# EAGLE board Schematic_BG96_Mega2560 (EAGLE 9.5.2)
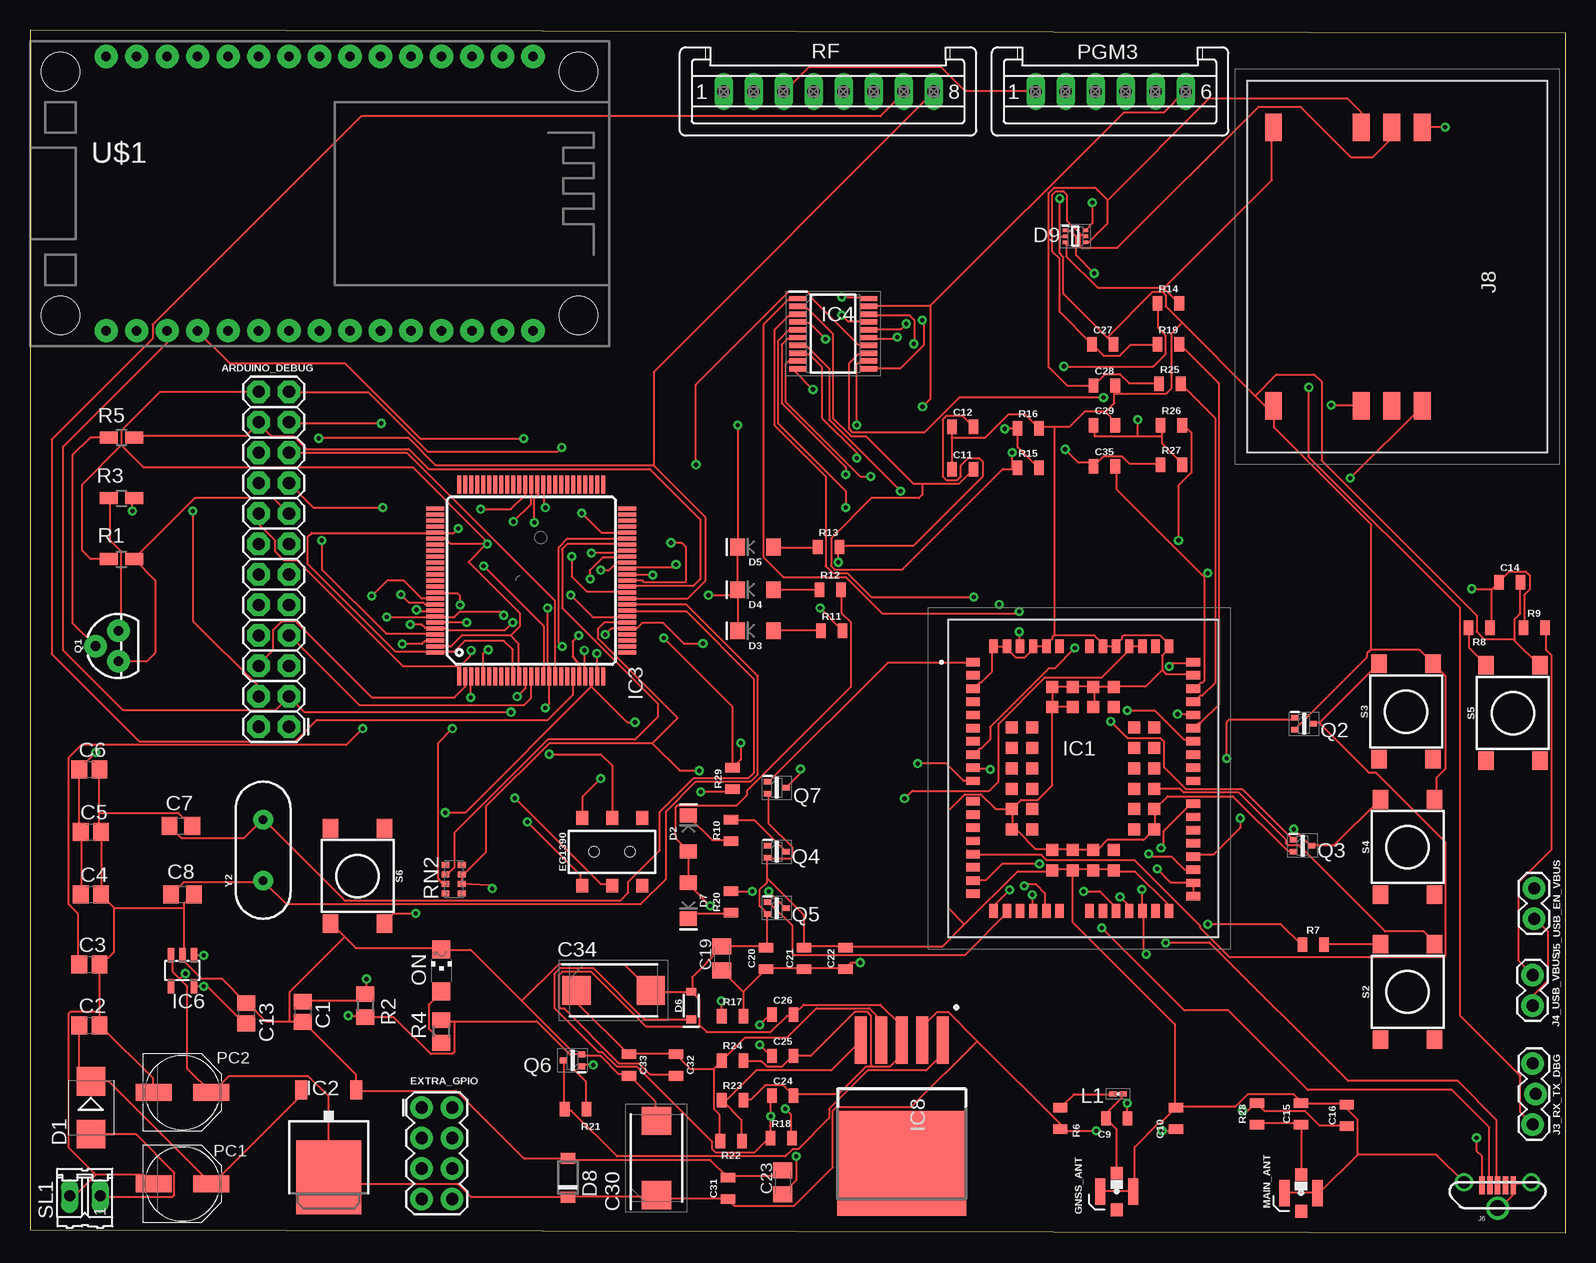
[diagram p2: board, top side]
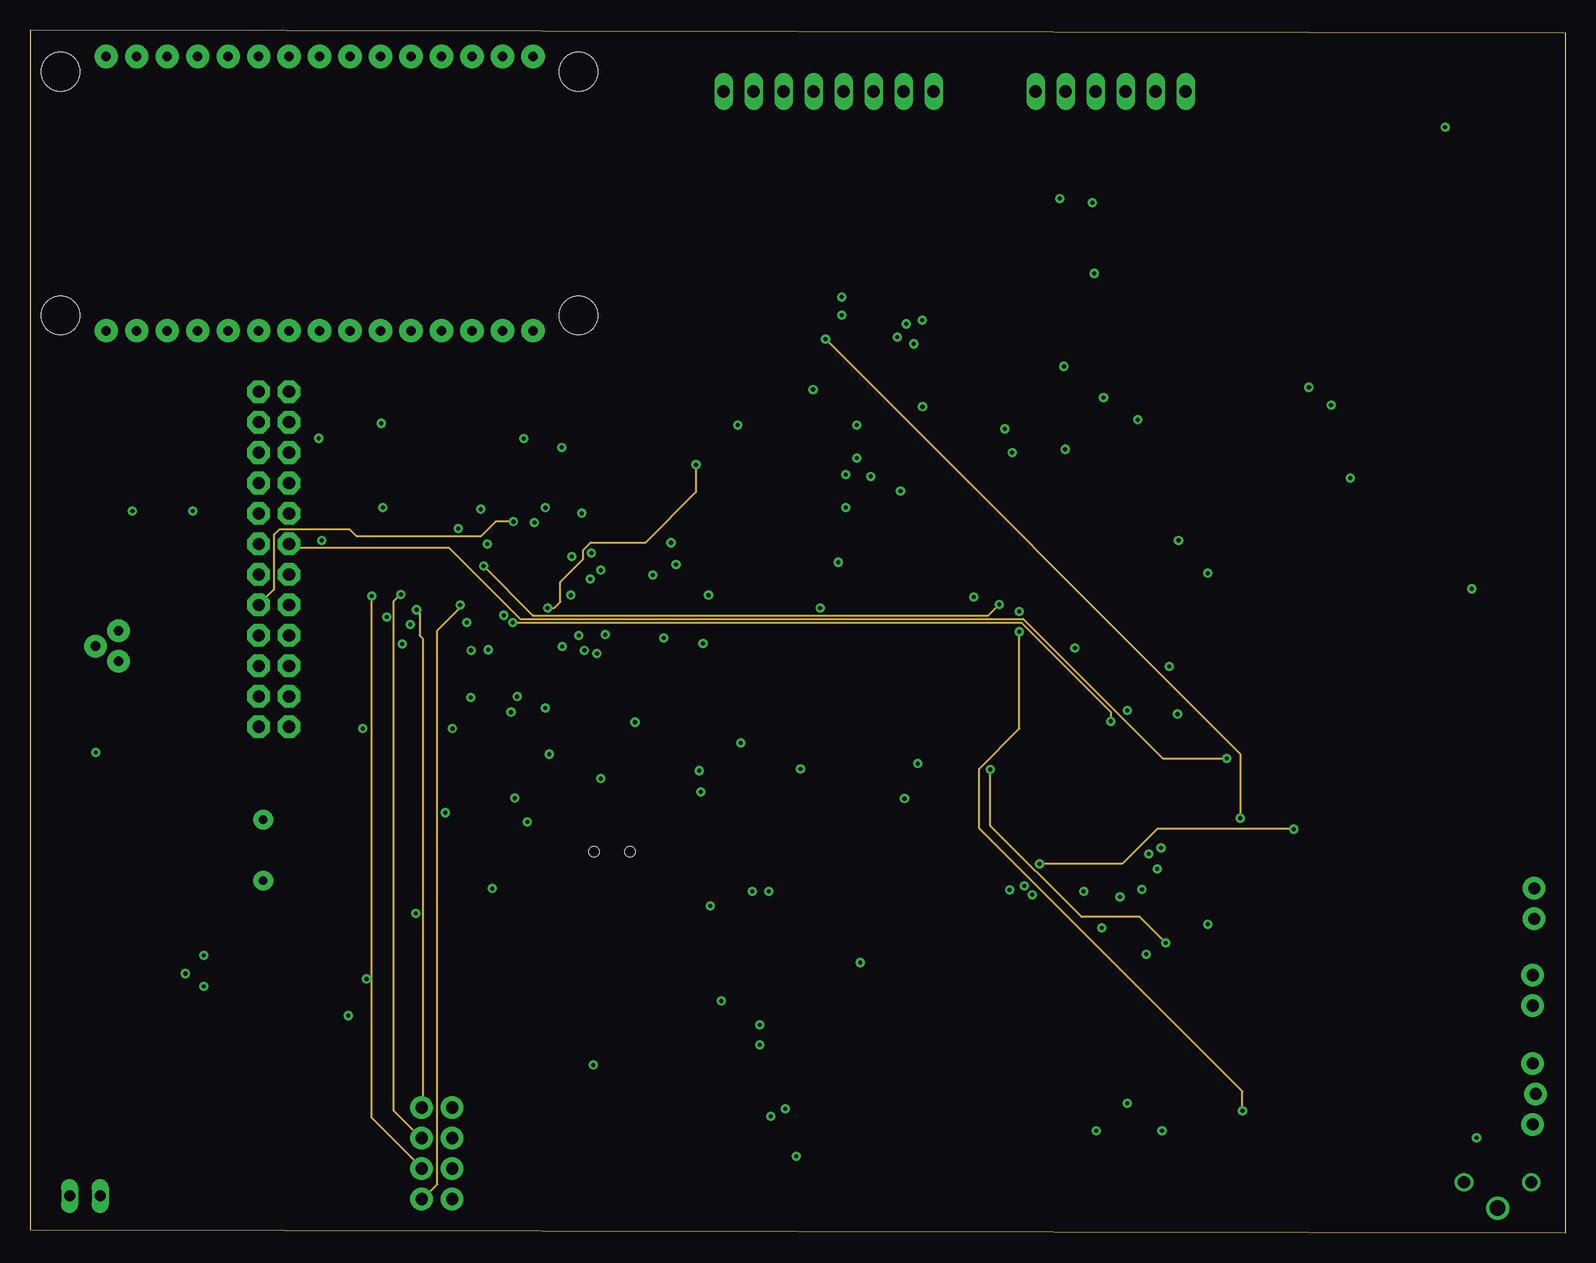
[diagram p3: board, inner layer Route2]
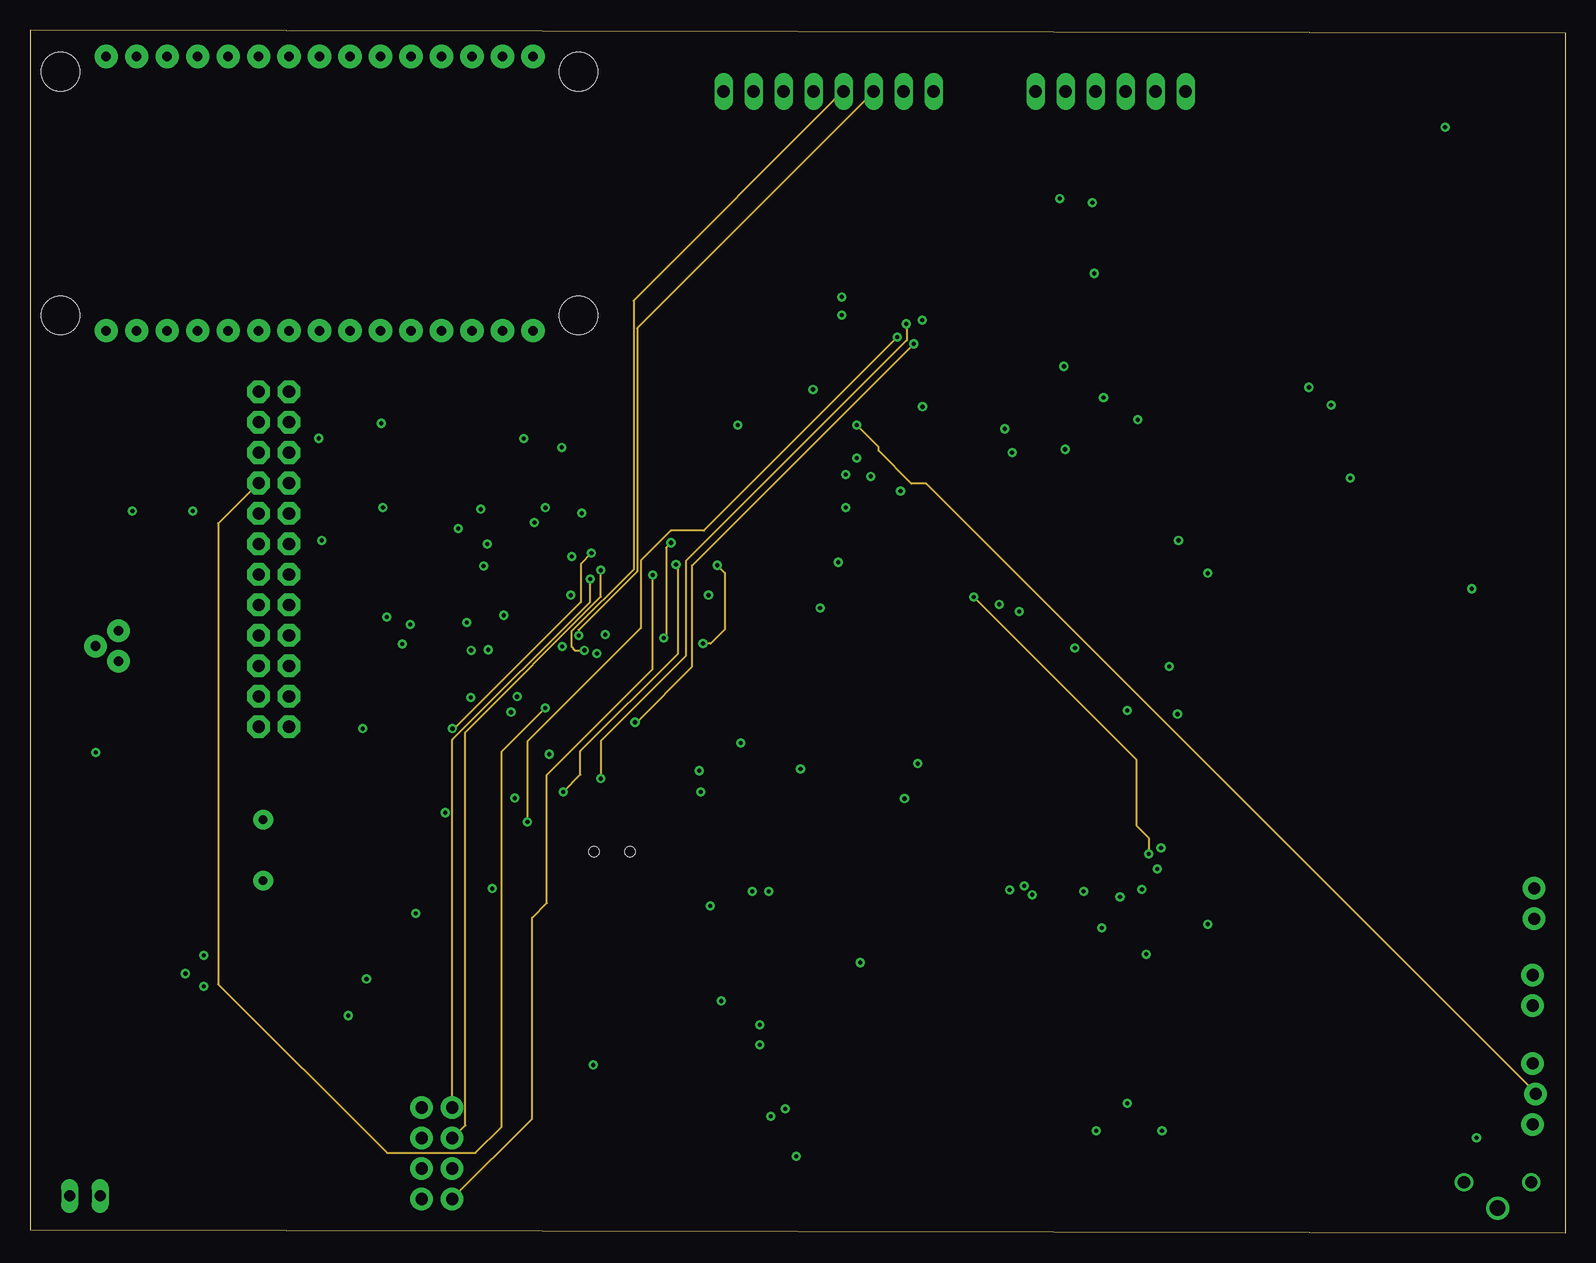
[diagram p4: board, inner layer Route15]
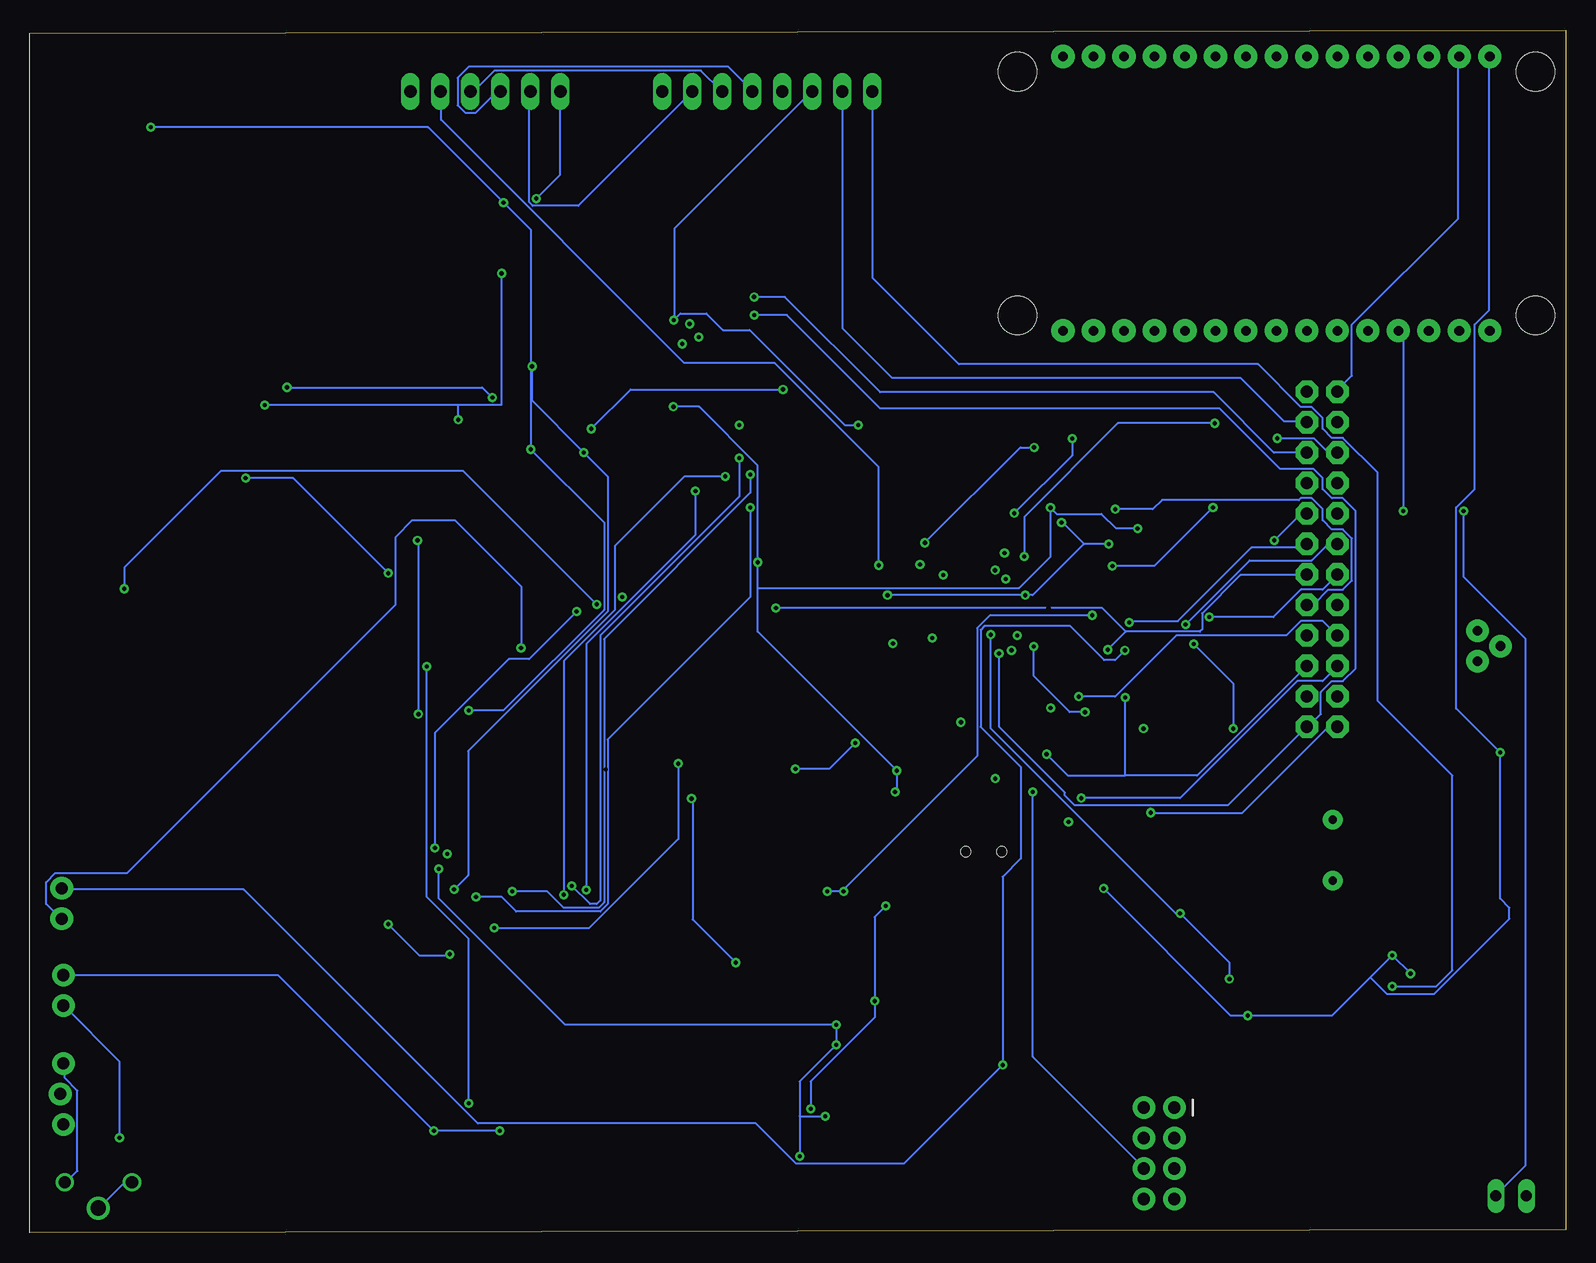
[diagram p5: board, bottom side, seen from below]

Size 128 x 100.25 mm. Coordinates in mm from the lower left corner, seen from the top.
Outline: 0,0.25 128,0 128,100 0,100.25 0,0.25
Copper layers ([2:1+(2*15)+16:15]): Top 0.04mm / dielectric 0.3mm / Route2 0.04mm / dielectric 0.3mm / Route15 0.04mm / dielectric 0.3mm / Bottom 0.04mm
Design rules "default *": minimum track width 6mil, minimum drill 0.35mm, track to track 6mil, track to pad 6mil, pad to pad 6mil, via to via 6mil, smd to smd 6mil, copper to edge 40mil, drill to drill 6mil, minimum pad ring 10mil, minimum via ring 8mil, stop-mask expansion 4mil, vias tented up to drill 0mil, thermal gap 10mil

## Footprints (pad centres in the part's own frame; a part is rotated, then mirrored left to right if it is on the bottom)
2X12 = drill 1.016 pad 1.88 octagon: 1 0,0; 2 0,2.54; 3 2.54,0; 4 2.54,2.54; 5 5.08,0; 6 5.08,2.54; 7 7.62,0; 8 7.62,2.54; 9 10.16,0; 10 10.16,2.54; 11 12.7,0; 12 12.7,2.54; 13 15.24,0; 14 15.24,2.54; 15 17.78,0; 16 17.78,2.54; 17 20.32,0; 18 20.32,2.54; 19 22.86,0; 20 22.86,2.54; 21 25.4,0; 22 25.4,2.54; 23 27.94,0; 24 27.94,2.54
C0805 = smd 1.3 x 1.5: 1 -0.85,0; 2 0.85,0
C0805' = smd 1.3 x 1.5: 1 -0.95,0; 2 0.95,0
0805 = smd 0.8 x 1.2: 1 -0.9,0; 2 0.9,0
C0805K = smd 1.3 x 1.6: 1 -1,0; 2 1,0
CAPPM7343X310N = smd 2.35 x 2.45: 1 -3.1,0; 2 3.1,0
SMB = smd 2.4 x 2.4: A 2.2,0; C -2.2,0
LED-1206 = smd 1.2 x 1.4: A -1.5,0; C 1.5,0
SOD-323 = smd 0.63 x 0.83: A 1.15,0; C -1.15,0
SOD123FL = smd 0.91 x 1.22: A 1.625,0; C -1.625,0
SOTFL50P160X60-6N = smd 0.475 x 0.3: 1 -0.838,0.5; 2 -0.838,0; 3 -0.838,-0.5; 4 0.838,-0.5; 5 0.838,0; 6 0.838,0.5
SWITCH_DPDT_SMD_AYZ0202 = smd 1 x 1.15: 1 -2.5,2.825; 2 0,2.825; 3 2.5,2.825; 4 -2.5,-2.825; 5 0,-2.825; 6 2.5,-2.825 | hole 0.85: 1.5,0; -1.5,0
2X4 = drill 1.016 pad 1.88: 1 -3.81,-1.27; 2 -3.81,1.27; 3 -1.27,-1.27; 4 -1.27,1.27; 5 1.27,-1.27; 6 1.27,1.27; 7 3.81,-1.27; 8 3.81,1.27
U.FL = smd 2.2 x 0.85: 1 0,1.375; 2 0,-1.375 | smd 1.05 x 1: FEED 1.525,0; NC -1.525,0
BG96MA = smd 1.15 x 0.7: 1 -9.18,9.7; 2 -9.18,8.6; 3 -9.18,7.5; 4 -9.18,6.4; 5 -9.18,5.3; 6 -9.18,4.2; 7 -9.18,3.1; 8 -9.18,2; 9 -9.18,0.9; 10 -9.18,-0.2; 11 -9.18,-1.9; 12 -9.18,-3; 13 -9.18,-4.1; 14 -9.18,-5.2; 15 -9.18,-6.3; 16 -9.18,-7.4; 17 -9.18,-8.5; 18 -9.18,-9.6; 32 9.18,-9.8; 33 9.18,-8.7; 34 9.18,-7.6; 35 9.18,-6.5; 36 9.18,-5.4; 37 9.18,-4.3; 38 9.18,-3.2; 39 9.18,-2.1; 40 9.18,-0.2; 41 9.18,0.9; 42 9.18,2; 43 9.18,3.1; 44 9.18,4.2; 45 9.18,5.3; 46 9.18,6.4; 47 9.18,7.5; 48 9.18,8.6; 49 9.18,9.7 | smd 0.7 x 1.15: 19 -7.45,-11.025; 20 -6.35,-11.025; 21 -5.25,-11.025; 22 -4.15,-11.025; 23 -3.05,-11.025; 24 -1.95,-11.025; 25 0.55,-11.025; 26 1.65,-11.025; 27 2.75,-11.025; 28 3.85,-11.025; 29 4.95,-11.025; 30 6.05,-11.025; 31 7.15,-11.025; 50 7.15,11.025; 51 6.05,11.025; 52 4.95,11.025; 53 3.85,11.025; 54 2.75,11.025; 55 1.65,11.025; 56 0.55,11.025; 57 -1.95,11.025; 58 -3.05,11.025; 59 -4.15,11.025; 60 -5.25,11.025; 61 -6.35,11.025; 62 -7.45,11.025 | smd 1 x 1: 63 -5.95,4.25; 64 -5.95,2.55; 65 -5.95,0.85; 66 -5.95,-0.85; 67 -5.95,-2.55; 68 -5.95,-4.25; 69 -2.55,-7.65; 70 -0.85,-7.65; 71 0.85,-7.65; 72 2.55,-7.65; 73 5.95,-4.25; 74 5.95,-2.55; 75 5.95,-0.85; 76 5.95,0.85; 77 5.95,2.55; 78 5.95,4.25; 79 2.55,7.65; 80 0.85,7.65; 81 -0.85,7.65; 82 -2.55,7.65; 83 -4.25,4.25; 84 -4.25,2.55; 85 -4.25,0.85; 86 -4.25,-0.85; 87 -4.25,-2.55; 88 -4.25,-4.25; 89 -2.55,-5.95; 90 -0.85,-5.95; 91 0.85,-5.95; 92 2.55,-5.95; 93 4.25,-4.25; 94 4.25,-2.55; 95 4.25,-0.85; 96 4.25,0.85; 97 4.25,2.55; 98 4.25,4.25; 99 2.55,5.95; 100 0.85,5.95; 101 -0.85,5.95; 102 -2.55,5.95
DPACK = smd 1 x 1.6: 1 -2.28,-4.8; 3 2.28,-4.8 | smd 5.4 x 6.2: 2 0,2.5
TQFP100 = smd 1.5 x 0.35: 1 -8,6; 2 -8,5.5; 3 -8,5; 4 -8,4.5; 5 -8,4; 6 -8,3.5; 7 -8,3; 8 -8,2.5; 9 -8,2; 10 -8,1.5; 11 -8,1; 12 -8,0.5; 13 -8,0; 14 -8,-0.5; 15 -8,-1; 16 -8,-1.5; 17 -8,-2; 18 -8,-2.5; 19 -8,-3; 20 -8,-3.5; 21 -8,-4; 22 -8,-4.5; 23 -8,-5; 24 -8,-5.5; 25 -8,-6; 51 8,-6; 52 8,-5.5; 53 8,-5; 54 8,-4.5; 55 8,-4; 56 8,-3.5; 57 8,-3; 58 8,-2.5; 59 8,-2; 60 8,-1.5; 61 8,-1; 62 8,-0.5; 63 8,0; 64 8,0.5; 65 8,1; 66 8,1.5; 67 8,2; 68 8,2.5; 69 8,3; 70 8,3.5; 71 8,4; 72 8,4.5; 73 8,5; 74 8,5.5; 75 8,6 | smd 0.35 x 1.5: 26 -6,-8; 27 -5.5,-8; 28 -5,-8; 29 -4.5,-8; 30 -4,-8; 31 -3.5,-8; 32 -3,-8; 33 -2.5,-8; 34 -2,-8; 35 -1.5,-8; 36 -1,-8; 37 -0.5,-8; 38 0,-8; 39 0.5,-8; 40 1,-8; 41 1.5,-8; 42 2,-8; 43 2.5,-8; 44 3,-8; 45 3.5,-8; 46 4,-8; 47 4.5,-8; 48 5,-8; 49 5.5,-8; 50 6,-8; 76 6,8; 77 5.5,8; 78 5,8; 79 4.5,8; 80 4,8; 81 3.5,8; 82 3,8; 83 2.5,8; 84 2,8; 85 1.5,8; 86 1,8; 87 0.5,8; 88 0,8; 89 -0.5,8; 90 -1,8; 91 -1.5,8; 92 -2,8; 93 -2.5,8; 94 -3,8; 95 -3.5,8; 96 -4,8; 97 -4.5,8; 98 -5,8; 99 -5.5,8; 100 -6,8
SOP65P640X120-20N = smd 1.475 x 0.45: 1 -2.938,2.925; 2 -2.938,2.275; 3 -2.938,1.625; 4 -2.938,0.975; 5 -2.938,0.325; 6 -2.938,-0.325; 7 -2.938,-0.975; 8 -2.938,-1.625; 9 -2.938,-2.275; 10 -2.938,-2.925; 11 2.938,-2.925; 12 2.938,-2.275; 13 2.938,-1.625; 14 2.938,-0.975; 15 2.938,-0.325; 16 2.938,0.325; 17 2.938,0.975; 18 2.938,1.625; 19 2.938,2.275; 20 2.938,2.925
SOT23-DBV = smd 0.55 x 1.2: 1 -0.95,-1.3; 2 0,-1.3; 3 0.95,-1.3; 4 0.95,1.3; 5 -0.95,1.3
6-PIN-TO-263 = smd 3.95 x 1: 1 -13.25,-1.93; 2 -13.25,-3.632; 3 -13.25,-5.334; 4 -13.25,-7.036; 5 -13.25,-8.738 | smd 8.75 x 10.75: 6 -3,-5.334
1X03_LOCK = drill 1.016 pad 1.88: 1 0,0.127; 2 2.54,-0.127; 3 5.08,0.127
1X02 = drill 1.016 pad 1.88: 1 0,0; 2 2.54,0
USB-B-MICRO-SMD_VERT = smd 0.45 x 1.5: D+ 0,0; D- -0.65,0; GND 1.3,0; ID 0.65,0; VBUS -1.3,0 | drill 1.016: P1 -2.8,0.25; P2 2.8,0.25 | drill 1.27: P3 0,-1.9
MOLEX-912283001 = smd 2.3 x 1.4: C8(GND) 11.6,-10.3; CLK -11.6,-2.98; GND 11.6,2.1; I/O 11.6,-2.98; PRSNC -11.6,-10.3; RST -11.6,-0.44; VCC -11.6,2.1; VPP 11.6,-0.44
INDC0603X33N = smd 0.65 x 0.4: 1 -0.4,0; 2 0.4,0
CHIPLED_1206 = smd 1.5 x 1.5: A 0,-1.75; C 0,1.75
PANASONIC_D = smd 3 x 1.4: + 2.4,0; - -2.4,0
S06P = drill 1.016 long: 1 6.25,0; 2 3.75,0; 3 1.25,0; 4 -1.25,0; 5 -3.75,0; 6 -6.25,0
TO-92-EZ = drill 0.813 pad 1.88: 1 -1.27,0; 2 0,1.905; 3 1.27,0
SOTFL50P160X85-3N = smd 0.64 x 0.48: 1 -0.75,0.5; 2 -0.75,-0.5; 3 0.75,0
R0805W = smd 1.5 x 1: 1 -1.052,0; 2 1.052,0
R0805 = smd 1.3 x 1.5: 1 -0.95,0; 2 0.95,0
S08P = drill 1.016 long: 1 8.75,0; 2 6.25,0; 3 3.75,0; 4 1.25,0; 5 -1.25,0; 6 -3.75,0; 7 -6.25,0; 8 -8.75,0
CAT16 = smd 0.5 x 0.65: 1 -1.2,-0.675; 2 -0.4,-0.675; 3 0.4,-0.675; 4 1.2,-0.675; 5 1.2,0.675; 6 0.4,0.675; 7 -0.4,0.675; 8 -1.2,0.675
TACTILE_SWITCH_SMD_6.2MM_TALL = smd 1.55 x 1.3: A1 -3.975,-2.25; A2 3.975,-2.25; B1 -3.975,2.25; B2 3.975,2.25
02P = drill 0.914 long: 1 -1.27,0; 2 1.27,0
ESP12E_DEVKIT = drill 0.8 pad 1.93: 3V3@0 -11.43,-7.62; 3V3@1 11.43,5.08; 3V3@2 11.43,-17.78; AD0 -11.43,17.78; CLK -11.43,-2.54; CMD -11.43,2.54; D0 11.43,17.78; D1 11.43,15.24; D2 11.43,12.7; D3 11.43,10.16; D4 11.43,7.62; D5 11.43,0; D6 11.43,-2.54; D7 11.43,-5.08; D8 11.43,-7.62; EN -11.43,-10.16; GND@0 -11.43,-5.08; GND@1 -11.43,-15.24; GND@2 11.43,2.54; GND@3 11.43,-15.24; RST -11.43,-12.7; RSV@0 -11.43,15.24; RSV@1 -11.43,12.7; RX 11.43,-10.16; SD0 -11.43,0; SD1 -11.43,5.08; SD2 -11.43,7.62; SD3 -11.43,10.16; TX 11.43,-12.7; VIN -11.43,-17.78 | hole 3.2: -10.16,21.59; 10.16,21.59; 10.16,-21.59; -10.16,-21.59
HC49US = drill 0.7 pad 1.651: 1 -2.54,0; 2 2.54,0

## Placement (x,y rotation side)
ARDUINO_DEBUG  CONN_12X2  [2X12]  21.59,42.16 90 top
C1  22p  [C0805]  22.73,18.42 270 top
C2  100n  [C0805]  4.95,17.27 0 top
C3  100n  [C0805]  4.95,22.35 0 top
C4  100n  [C0805]  5.08,28.19 0 top
C5  100n  [C0805]  5.08,33.4 0 top
C6  100n  [C0805]  4.95,38.61 0 top
C7  22pF  [C0805']  12.57,33.91 0 top
C8  22pF  [C0805']  12.7,28.19 0 top
C9  100pF  [0805]  90.55,9.53 0 top
C10  0.1µF  [0805]  95.5,9.53 90 top
C11  0.1µF  [0805]  77.72,63.63 0 top
C12  0.1µF  [0805]  77.72,67.18 0 top
C13  100n  [C0805]  18.03,18.29 270 top
C14  0.1µF  [0805]  123.32,54.23 0 top
C15  0.1µF  [0805]  105.92,9.91 90 top
C16  0.1µF  [0805]  109.73,9.78 90 top
C19  100µF  [C0805K]  57.66,22.86 90 top
C20  0.1µF  [0805]  61.34,22.86 90 top
C21  33pF  [0805]  64.52,22.86 90 top
C22  10pF  [0805]  67.94,22.86 90 top
C23  100µF  [C0805K]  62.74,4.19 90 top
C24  0.1µF  [0805]  62.74,11.43 0 top
C25  33pF  [0805]  62.74,14.73 0 top
C26  10pF  [0805]  62.74,18.16 0 top
C27  33pF  [0805]  89.41,74.04 0 top
C28  33pF  [0805]  89.53,70.61 0 top
C29  33pF  [0805]  89.53,67.31 0 top
C30  470µF  [CAPPM7343X310N]  52.2,6.22 90 top
C31  100nF  [0805]  58.17,3.68 90 top
C32  10pF  [0805]  53.85,13.97 270 top
C33  33pF  [0805]  49.91,13.97 270 top
C34  470µF  [CAPPM7343X310N]  48.64,20.19 0 top
C35  100nF  [0805]  89.53,63.88 0 top
D1  M7  [SMB]  5.08,10.41 270 top
D2  BLUE  [LED-1206]  54.86,33.27 90 top
D3  BLUE  [LED-1206]  60.45,50.16 180 top
D4  GREEN  [LED-1206]  60.45,53.59 180 top
D5  RED  [LED-1206]  60.45,57.15 180 top
D6  5.1V  [SOD-323]  55.12,18.92 90 top
D7  RED  [LED-1206]  54.86,27.69 270 top
D8  TVS_5V  [SOD123FL]  44.83,4.57 90 top
D9  ESDA6V8AV6  [SOTFL50P160X60-6N]  87.12,83.06 0 top
EG1390  [SWITCH_DPDT_SMD_AYZ0202]  48.51,31.75 0 top
EXTRA_GPIO  [2X4]  33.91,6.6 270 top
GNSS_ANT  U.FL  [U.FL]  90.55,3.43 90 top
IC1  BG96MA  [BG96MA]  87.76,37.85 0 top
IC2  MC33269D-5.0  [DPACK]  24.89,7.11 180 top
IC3  ATMEGA2560-16AU  [TQFP100]  41.78,54.36 90 top
IC4  TXS0108PWR  [SOP65P640X120-20N]  66.93,74.93 0 top
IC6  LP2985-33DBVR  [SOT23-DBV]  12.7,21.84 180 top
IC8  MIC29302WU  [6-PIN-TO-263]  77.98,2.79 270 top
J3_RX_TX_DBG  [1X03_LOCK]  125.35,9.02 90 top
J4_USB_VBUS  [1X02]  125.22,18.92 90 top
J5_USB_EN_VBUS  [1X02]  125.35,26.16 90 top
J6  WM9734TR-ND  [USB-B-MICRO-SMD_VERT]  122.3,3.94 0 top
J8  MOLEX-91228-3001  [MOLEX-912283001]  113.92,80.52 270 top
L1  MLG0603P47NH  [INDC0603X33N]  90.68,11.56 0 top
MAIN_ANT  U.FL  [U.FL]  105.92,3.3 90 top
ON  GREEN  [CHIPLED_1206]  34.29,21.84 0 top
PC1  47u  [PANASONIC_D]  12.7,4.06 0 top
PC2  47u  [PANASONIC_D]  12.7,11.68 0 top
PGM3  [S06P]  90.04,95.12 180 top
Q1  200mA/40V  [TO-92-EZ]  7.37,48.89 90 top
Q2  DTC043ZE  [SOTFL50P160X85-3N]  106.17,42.42 0 top
Q3  DTC043ZE  [SOTFL50P160X85-3N]  106.05,32.26 0 top
Q4  DTC043ZE  [SOTFL50P160X85-3N]  62.23,31.75 0 top
Q5  DTC043ZE  [SOTFL50P160X85-3N]  62.23,27.05 0 top
Q6  DTC143ZEBTL  [SOTFL50P160X85-3N]  45.21,14.35 180 top
Q7  DTC043ZE  [SOTFL50P160X85-3N]  62.23,37.08 0 top
R1  22K  [R0805W]  7.62,56.13 0 top
R2  10K  [R0805]  27.94,18.92 270 top
R3  10K  [R0805W]  7.62,61.21 0 top
R4  1K  [R0805]  34.29,16.76 90 top
R5  10K  [R0805W]  7.62,66.29 0 top
R6  10E  [0805]  85.85,9.53 90 top
R7  10K  [0805]  106.93,24 0 top
R8  1K  [0805]  120.78,50.42 180 top
R9  10K  [0805]  125.35,50.42 0 top
R10  1K  [0805]  58.42,33.53 90 top
R11  1K  [0805]  66.8,50.16 0 top
R12  1K  [0805]  66.67,53.59 0 top
R13  1K  [0805]  66.55,57.15 0 top
R14  51K  [0805]  94.87,77.47 0 top
R15  15K  [0805]  83.19,63.75 0 top
R16  120K  [0805]  83.19,67.06 0 top
R17  0E  [0805]  58.55,18.03 0 top
R18  0E  [0805]  62.61,7.87 0 top
R19  0E  [0805]  94.87,74.04 0 top
R20  1K  [0805]  58.42,27.56 90 top
R21  51K  [0805]  45.47,10.29 180 top
R22  100K  [0805]  58.42,7.62 180 top
R23  47K  [0805]  58.55,11.05 0 top
R24  470E  [0805]  58.55,14.35 180 top
R25  0E  [0805]  95,70.74 0 top
R26  0E  [0805]  95.12,67.31 0 top
R27  15K  [0805]  95.12,64.01 0 top
R28  0E  [0805]  102.23,9.91 90 top
R29  10K  [0805]  58.55,37.85 90 top
RF  [S08P]  66.55,95.12 180 top
RN2  10K  [CAT16]  35.31,29.46 270 top
S2  USB_BOOT_SMD-6.2  [TACTILE_SWITCH_SMD_6.2MM_TALL]  114.81,20.07 90 top
S3  PWR_KEY_SMD-6.2  [TACTILE_SWITCH_SMD_6.2MM_TALL]  114.68,43.43 90 top
S4  RST_SMD-6.2  [TACTILE_SWITCH_SMD_6.2MM_TALL]  114.81,32.13 90 top
S5  USR_SMD-6.2  [TACTILE_SWITCH_SMD_6.2MM_TALL]  123.57,43.31 90 top
S6  ARD_RST  [TACTILE_SWITCH_SMD_6.2MM_TALL]  27.3,29.72 270 top
SL1  [02P]  4.57,3.05 180 top
U$1  ESP12E_DEVKIT  [ESP12E_DEVKIT]  24.13,86.61 270 top
Y2  16MHz  [HC49US]  19.43,31.88 270 top

## Tracks (layer width: path | path; a pad name or v marks a point on that pad's centre or on a via)
3.8V
  Top 0.152: 57,13.66 57,10.31 57.45,9.86 57.45,7.72 R22.2 | 57,13.66 57.61,14.28 R24.2 57.76,14.43 59.59,16.26 63.09,16.26 65.53,18.69 69.95,18.69 70.87,17.78 70.87,16.1 IC8.4 | C34.1 45.57,20.07 45.57,19.15 49.84,14.88 C33.1 49.99,14.88 53.8,14.88 C32.1 53.95,14.73 55.02,13.66 57,13.66
+3V3  (via drill 0.35)
  Top 0.152: IC6.5 13.72,20.52 v14.48,20.52 14.78,20.52 17.98,17.32 C13.2
  Bottom 0.152: RF.1 57.8,79.59 50.6,72.39 25.65,72.39 22.1,68.83 21.18,68.83 20.27,67.92 20.27,67.01 19.51,66.24 18.59,66.24 15.7,63.35 15.7,44.32 9.47,38.1 9.47,21.87 10.82,20.52 v14.48,20.52
+5V  (via drill 0.35)
  Top 0.152: 74.98,77.22 75.03,77.22 75.03,69.49 v74.38,68.84 | 74.98,77.22 69.95,77.22 IC4.19 | 74.98,77.22 91.14,93.37 94.49,93.37 96.16,95.05 PGM3.6 | IC3.10 40.23,46.43 40.23,48.59 39.5,49.33 36.22,49.33 35.31,48.41 33.83,48.41 IC3.100 33.68,48.41 30.48,48.41 23.16,55.73 23.16,58.01 23.47,58.32 33.68,58.32 IC3.80 33.83,58.32 35.32,58.32 v35.7,58.69 | v42.95,60.43 42.82,60.55 42.82,62.28 IC3.61 | C12.2 78.49,67.31 77.72,68.07 76.35,68.07 76.05,67.77 76.05,63.04 76.35,62.74 77.27,62.74 77.57,63.04 77.57,63.96 78.18,64.57 79.1,64.57 79.4,64.26 79.4,63.04 73.61,57.25 67.51,57.25 R13.2 67.36,57.1 v67.36,55.88 | 51.84,40.79 43.28,40.79 38,35.51 38,31.7 36.27,29.97 36.12,29.97 RN2.7 35.97,29.82 35.97,29.21 RN2.6 38.25,28.96 v38.53,28.68 | 51.84,40.79 53.96,42.91 47.31,49.56 47.31,50.32 47.84,50.85 49.68,50.85 IC3.31 | R29.1 58.33,36.73 v55.91,36.73 | v55.78,38.51 54.13,38.51 51.84,40.79 | C4.1 4.27,28.3 4.27,33.32 C5.1 4.12,33.48 4.12,38.51 C6.1 4.12,38.66 v5.49,40.03 | R9.2 126.34,50.39 126.34,48.56 126.8,48.11 126.8,31.95 124.05,29.21 124.05,22.66 125.12,21.59 J4_USB_VBUS.2 | 78.94,15.95 76.5,18.39 75.59,18.39 74.37,17.17 74.37,16.1 IC8.2 | 78.94,15.95 85.8,9.09 85.8,8.64 R6.1 85.95,8.48 v88.85,8.48 | v94.34,8.48 95.4,8.48 C10.1 | 35.36,17.63 34.29,17.63 R4.2 | 35.36,17.63 42.22,17.63 45.11,14.73 45.11,13.82 46.33,12.6 46.33,10.31 R21.1 | 35.36,17.63 35.36,15.04 35.2,14.88 33.38,14.88 30.33,17.93 28.04,17.93 R2.2 27.89,18.09 v26.52,18.09 | 12.5,21.13 13.11,20.52 13.11,13.66 15.09,11.68 PC2.+ 15.24,11.68 16.61,13.06 23.16,13.06 24.84,11.38 24.84,4.67 IC2.2 24.99,4.52 25.45,4.06 35.66,4.06 36.73,3 44.81,3 D8.C 44.96,3 52.12,3 C30.1 52.27,3 52.43,2.85 58.06,2.85 C31.1 58.22,2.69 58.67,2.24 63.7,2.24 66.9,5.44 66.9,10.16 67.21,10.46 73.46,10.46 78.94,15.95
  Top 0.152: 12.5,21.13 11.89,21.74 11.89,23.11 IC6.3 | v14.48,23.11 13.72,23.11 IC6.1 | 12.5,21.13 v12.95,21.59
  Bottom 0.152: v35.7,58.69 37.49,58.69 38.72,59.92 42.44,59.92 v42.95,60.43 42.95,56.36 45.57,53.75 67.36,53.75 | v55.91,36.73 55.78,36.85 v55.78,38.51 67.36,50.09 67.36,53.75 | 67.36,53.75 v67.36,55.88 67.36,63.96 72.25,68.84 v74.38,68.84 | U$1.VIN 6.4,97.94 6.4,76.91 7.62,75.69 7.62,61.98 9.14,60.45 9.14,43.69 v5.49,40.03 5.49,27.84 4.72,27.08 4.72,26.16 10.97,19.91 14.94,19.91 16.31,21.29 | v88.85,8.48 v94.34,8.48 107.29,21.44 125.12,21.44 J4_USB_VBUS.2 | v12.95,21.59 v14.48,23.11 16.31,21.29 | 16.31,21.29 19.51,18.09 v26.52,18.09 27.94,18.09 v38.53,28.68
A4  (via drill 0.35 layers 1-2)
  Top 0.152: IC3.93 33.72,51.79 32.33,51.79 v32.21,51.92
  Route2 0.152: v32.21,51.92 32.46,51.66 32.46,49.78 32.77,49.48 32.77,10.46 EXTRA_GPIO.1
A5  (via drill 0.35 layers 1-2)
  Top 0.152: v30.91,53.19 31.57,52.53 32.77,52.53 32.92,52.38 33.68,52.38 IC3.92
  Route2 0.152: v30.91,53.19 30.86,53.19 30.33,52.65 30.33,10.16 32.61,7.87 EXTRA_GPIO.3
A6  (via drill 0.35 layers 1-2)
  Top 0.152: IC3.91 32.64,52.86 31.14,54.36 29.77,54.36 v28.47,53.06
  Route2 0.152: v28.47,53.06 28.47,9.58 32.61,5.44 EXTRA_GPIO.5
A7  (via drill 0.35 layers 1-2)
  Top 0.152: v35.84,52.32 35.84,53.09 35.64,53.29 33.83,53.29 IC3.90
  Route2 0.152: v35.84,52.32 35.84,52.09 33.95,50.2 33.95,4.03 32.76,2.84 EXTRA_GPIO.7
A_RX  (via drill 0.35)
  Top 0.152: v40.39,36.22 47.55,29.06 48.46,29.06 EG1390.5 | IC3.2 36.27,46.28 36.27,45.52 35.36,44.6 28.5,44.6 22.1,51 21.03,51 20.27,50.24 20.27,48.56 19.05,47.35 ARDUINO_DEBUG.6
  Bottom 0.152: v40.39,36.22 32.16,36.22 22.4,45.97 20.27,45.97 19.05,47.19 ARDUINO_DEBUG.6
A_STATUS  (via drill 0.35)
  Top 0.152: v61.57,28.45 62.94,27.08 Q5.3 | v60.2,28.45 58.52,28.45 R20.2 | v29.72,51.31 33.68,51.31 IC3.94 33.83,51.31 35.36,51.31 35.76,51.71 39.22,51.71 v39.47,51.46
  Bottom 0.152: v61.57,28.45 v60.2,28.45 60.2,28.6 49.07,39.73 49.07,50.39 48.01,51.46 v39.47,51.46 | v29.72,51.31 24.38,51.31 22.1,53.59 20.27,53.59 19.05,54.81 ARDUINO_DEBUG.12
A_TX  (via drill 0.35)
  Top 0.152: v43.28,39.88 47.57,39.88 48.51,38.93 EG1390.2 | v36.73,44.6 36.73,46.28 IC3.3
  Bottom 0.152: 36.73,38.1 30.73,38.1 ARDUINO_DEBUG.5 | 36.73,38.1 41.5,38.1 v43.28,39.88 | 36.73,38.1 v36.73,44.6
ANTT_MAIN  (via drill 0.35 layers 1-2)
  Top 0.152: v82.45,50.09 82.45,49.02 IC1.60 | v101.04,10.16 101.5,10.16 102.11,10.77 R28.2 102.26,10.77 102.87,10.16 106.22,10.16 107.44,8.94 109.73,8.94 C16.1
  Route2 0.152: v82.45,50.09 82.45,42.01 79.1,38.66 79.1,33.71 101.04,11.76 v101.04,10.16
AP_READY  (via drill 0.35, 0.35 layers 1-2)
  Top 0.152: v55.5,64.01 55.5,70.69 63.25,78.44 64.77,78.44 65.08,78.13 65.08,77.98 69.04,74.02 69.8,74.02 IC4.14 | v43.13,52.07 43.13,47.35 43.28,47.19 43.28,46.43 | 43.28,46.43 IC3.16 | v42.95,43.74 43.28,44.07 43.28,46.43
  Route2 0.152: v55.5,64.01 55.5,61.72 51.31,57.53 46.74,57.53 46.1,56.9 46.1,56.13 44.2,54.23 44.2,52.58 43.69,52.07 v43.13,52.07
  Route15 0.152: ARDUINO_DEBUG.18 15.69,59.12 15.69,20.71 29.75,6.64 37.12,6.64 39.3,8.82 39.3,40.09 v42.95,43.74
AP_READY_D  (via drill 0.35)
  Top 0.152: v81.63,28.57 80.31,27.25 80.31,26.92 IC1.19 | v72.54,61.82 66.6,67.77 66.6,72.03 64.77,73.86 64.01,73.86 IC4.7
  Bottom 0.152: v81.63,28.57 81.63,49.07 72.54,58.17 v72.54,61.82
AREF  (via drill 0.35)
  Top 0.152: v27.74,42.01 26.36,40.64 4.27,40.64 3.2,39.57 3.2,27.38 3.96,26.62 3.96,22.35 C3.1 | v31.02,49.06 32.65,49.06 32.92,49.33 33.68,49.33 IC3.98
  Bottom 0.152: v27.74,42.01 27.74,45.78 v31.02,49.06
AT_COMM_RX  (via drill 0.35)
  Top 0.152: v73.65,74.09 73.69,74.13 73.69,76.08 73.32,76.45 69.95,76.45 IC4.18 | v50.42,42.54 49.76,42.54 46.79,45.52 | 46.79,45.52 46.79,46.28 IC3.23 | v34.59,35 36.27,35 46.79,45.52
  Route15 0.152: v73.65,74.09 55.18,55.62 55.18,47.18 50.55,42.54 v50.42,42.54
  Bottom 0.152: ARDUINO_DEBUG.2 19.81,42.16 26.98,35 v34.59,35
AT_COMM_RXD  (via drill 0.35)
  Top 0.152: v93.23,31.55 93.23,31.32 95.13,31.32 96.17,30.28 96.93,30.28 IC1.34 | v78.64,52.98 70.1,52.98 68.12,54.97 66.9,54.97 66.29,55.57 66.29,63.04 62.03,67.31 62.03,75.23 63.25,76.45 63.86,76.45 IC4.3
  Route15 0.152: v93.23,31.55 93.23,32.91 92.2,33.93 92.2,39.42 v78.64,52.98
AT_COMM_TX  (via drill 0.35)
  Top 0.152: IC4.17 69.84,75.94 68.19,75.94 v67.64,76.48 | v47.24,48.28 47.24,46.43 IC3.24
  Bottom 0.152: v67.64,76.48 64.93,76.48 57.15,68.71 28.87,68.71 23.82,63.65 21.03,63.65 20.27,62.89 20.27,61.98 19.51,61.21 18.59,61.21 17.53,60.15 17.53,47.04 18.59,45.97 19.51,45.97 20.42,45.06 20.42,43.23 21.49,42.16 ARDUINO_DEBUG.1 21.64,42.16 28.19,35.61 40.95,35.61 41.76,36.42 41.76,36.68 47.24,42.16 v47.24,48.28
AT_COMM_TXD  (via drill 0.35 layers 1-2)
  Top 0.152: v100.85,34.55 100.85,33.75 98.6,31.5 97.08,31.5 IC1.35 | v66.29,74.47 64.92,75.84 64.01,75.84 IC4.4
  Route2 0.152: v100.85,34.55 100.85,39.92 v66.29,74.47
BC547_BASE
  Top 0.152: 19.05,67.46 17.98,66.4 8.69,66.4 R5.2 | 19.05,67.46 20.12,66.4 21.95,66.4 23.01,65.33 31.55,65.33 33.22,63.65 51.66,63.65 55.85,59.46 55.85,54.48 55.27,53.9 49.84,53.9 IC3.37 | 19.05,67.46 ARDUINO_DEBUG.22
D42  (via drill 0.35)
  Top 0.152: v46.69,54.48 46.69,55.24 47.78,56.34 49.68,56.34 IC3.42
  Route15 0.152: v46.69,54.48 46.69,52.58 35.2,41.1 35.2,10.46 EXTRA_GPIO.2
D43  (via drill 0.35)
  Top 0.152: v47.57,55.22 48.26,55.22 48.92,55.88 49.68,55.88 IC3.41
  Route15 0.152: v47.57,55.22 47.57,53.01 36.27,41.71 36.27,8.94 35.2,7.87 EXTRA_GPIO.4
D44  (via drill 0.35, 0.35 layers 15-16)
  Top 0.152: v53.83,55.7 53.56,55.42 49.84,55.42 IC3.40
  Route15 0.152: v53.83,55.7 53.96,55.56 53.96,48.22 45.87,40.13 45.87,38.18 v44.43,36.74
  Bottom 0.152: v44.43,36.74 44.43,14.66 35.2,5.44 EXTRA_GPIO.6
D45  (via drill 0.35)
  Top 0.152: v51.89,54.81 49.84,54.81 IC3.39
  Route15 0.152: v51.89,54.81 51.89,46.99 43.07,38.17 43.07,27.48 41.84,26.24 41.84,9.48 35.2,2.85 EXTRA_GPIO.8
DBG_RX  (via drill 0.35)
  Top 0.152: v68.89,67.31 68.89,72.34 69.19,72.64 69.8,72.64 IC4.12
  Route15 0.152: v68.89,67.31 70.71,65.48 70.71,65.18 73.46,62.43 74.68,62.43 125.42,11.68 J3_RX_TX_DBG.2
DBG_RXD  (via drill 0.35)
  Top 0.152: v83.52,28.17 83.52,26.92 IC1.22 | v70.07,63.04 69.19,63.04 62.94,69.29 62.94,72.34 63.25,72.64 63.86,72.64 IC4.9
  Bottom 0.152: v83.52,28.17 83.52,47.65 79.25,51.92 79.25,57.25 73.46,63.04 v70.07,63.04
DBG_TX  (via drill 0.35)
  Top 0.152: v89.46,69.6 77.42,69.6 74.52,66.7 68.58,66.7 68.28,67.01 68.28,72.49 69.04,73.25 69.8,73.25 IC4.13 | v106.58,70.46 106.58,64.67 119.18,52.07 119.18,18.09 124.21,13.06 124.21,10.01 125.12,9.09 J3_RX_TX_DBG.1
  Bottom 0.152: v106.58,70.46 90.32,70.46 v89.46,69.6
DBG_TXD  (via drill 0.35)
  Top 0.152: v82.84,28.9 82.95,29.01 83.85,29.01 84.58,28.28 84.58,26.92 IC1.23 | v68.89,64.57 68.89,65.02 65.99,67.92 65.99,72.19 64.92,73.25 64.01,73.25 IC4.8
  Bottom 0.152: v82.84,28.9 81.32,27.38 80.77,27.38 80.47,27.69 80.47,49.78 68.89,61.37 v68.89,64.57
ENABLE  (via drill 0.35)
  Top 0.152: v46.94,13.97 46.02,13.97 Q6.1 | v36.75,48.54 36.63,48.41 36.63,48.01 35.81,47.19 | 35.81,47.19 35.81,46.43 IC3.1 | ARDUINO_DEBUG.16 19.05,59.08 20.42,57.71 20.42,56.79 21.18,56.03 22.28,56.03 31.11,47.19 35.81,47.19
  Bottom 0.152: v36.75,48.54 37.57,47.73 38.48,47.73 41.3,50.55 48.46,50.55 48.77,50.24 48.77,42.16 45.41,38.81 45.41,31.19 46.94,29.67 v46.94,13.97 55.17,5.74 64.16,5.74 67.51,9.09 90.68,9.09 110.19,28.6 125.27,28.6 J5_USB_EN_VBUS.2
ESP_RX  (via drill 0.35)
  Top 0.152: IC3.46 49.74,58.32 47.62,58.32 v45.97,59.97 | v41.15,66.19 32.51,66.19 26.24,72.47 16.64,72.47 14.02,75.08 U$1.RX | ARDUINO_DEBUG.4 19.05,45.52 13.56,51 v13.56,60.15
  Bottom 0.152: v45.97,59.97 41.15,64.8 v41.15,66.19 | v13.56,60.15 13.56,74.78 U$1.RX
ESP_TX  (via drill 0.35)
  Top 0.152: v44.35,48.87 44.04,49.17 44.04,57.12 44.78,57.86 49.68,57.86 IC3.45 | v40.08,43.38 22.86,43.38 21.64,44.6 ARDUINO_DEBUG.3 20.42,43.54 7.77,43.54 2.76,48.54 2.76,65.54 11.43,74.2 U$1.TX
  Bottom 0.152: v44.35,48.87 44.35,46.38 41.35,43.38 v40.08,43.38
GND  (via drill 0.35)
  Top 0.152: 12.8,27.08 12.8,27.38 13.56,28.14 C8.2 | 12.8,27.08 12.8,23.27 IC6.2 12.8,23.11 12.8,22.66 14.33,21.13 16,21.13 17.98,19.15 C13.1 18.14,19.15 19.66,17.63 21.64,17.63 | 5.79,35 5.79,33.48 C5.2 5.94,33.32 5.94,28.3 C4.2 5.94,28.14 7.01,27.08 | 5.79,35 5.79,38.51 C6.2 | 5.79,35 12.34,35 13.41,33.93 C7.2 | 7.01,27.08 12.8,27.08 | 5.49,4.83 3.81,3.15 3.35,3.15 SL1.2 | 5.49,4.83 9.45,4.83 10.21,4.06 PC1.- | 5.79,18.39 C3.2 5.94,22.35 7.01,23.42 7.01,27.08 | 5.79,18.39 5.79,17.32 C2.2 5.94,17.17 10.21,12.9 10.21,11.68 PC2.- | 5.49,4.83 3.2,7.11 3.2,18.24 3.35,18.39 5.79,18.39 | C23.2 62.64,5.13 62.18,4.67 58.22,4.67 C31.2 58.06,4.67 56.69,6.04 44.96,6.04 D8.A 44.81,6.2 41.15,6.2 35.51,11.84 27.28,11.84 IC2.1 27.13,11.99 27.13,13.21 22.86,17.48 C1.2 22.71,17.63 21.64,17.63 | C30.2 52.12,9.4 52.12,10.92 49.99,13.06 C33.2 49.84,13.21 49.07,13.21 47.55,14.73 46.02,14.73 Q6.2 45.87,14.88 45.41,14.88 41,19.3 | 26.21,24.64 25.15,25.71 S6.A2 | 26.21,24.64 27.13,23.72 34.29,23.72 ON.C 34.29,23.57 36.73,23.57 41,19.3 | 26.21,24.64 21.64,20.07 21.64,17.63 | C10.2 95.4,10.31 94.18,9.09 94.03,9.09 92.05,7.11 92.05,3.45 GNSS_ANT.2 91.9,3.45 89.31,3.45 GNSS_ANT.1 | MAIN_ANT.1 MAIN_ANT.2 107.44,3.3 110.64,6.5 | 110.64,6.5 110.64,9.4 109.73,10.31 C16.2 109.73,10.77 105.92,10.77 C15.2 105.92,10.92 105.31,11.53 101.5,11.53 100.43,10.46 95.56,10.46 C10.2 | J6.P2 124.97,4.06 123.75,4.06 J6.GND 123.6,3.91 123.6,3.15 122.38,1.93 J6.P3 | 110.64,6.5 117.2,6.5 119.48,4.22 J6.P1 | IC1.3 78.64,45.36 79.1,45.82 79.25,45.82 80.16,46.74 80.16,48.87 IC1.62 81.23,48.87 | 81.23,48.87 81.38,48.87 IC1.61 81.23,48.87
  Top 0.152: 81.23,48.87 82.14,47.95 82.91,47.95 83.52,48.56 83.52,48.87 IC1.59 83.67,48.87 84.58,48.87 IC1.58 84.73,49.02 85.19,49.48 85.19,49.63 85.34,49.78 | IC1.102 85.19,43.84 85.19,45.36 IC1.82 85.34,45.52 86.87,45.52 IC1.81 87.02,45.52 88.54,45.52 IC1.80 | IC1.101 86.87,43.84 85.34,43.84 IC1.102 | IC1.100 88.7,43.84 88.7,45.36 IC1.80 | IC1.80 88.7,45.52 90.22,45.52 IC1.79 90.37,45.52 92.96,45.52 94.34,46.89 | 94.34,46.89 94.64,46.58 96.93,46.58 IC1.48 | 94.34,46.89 94.34,48.11 94.79,48.56 94.79,48.87 IC1.50 94.94,49.02 94.18,49.78 91.14,49.78 90.98,49.63 90.98,49.48 90.53,49.02 IC1.54 90.37,48.87 89.46,48.87 IC1.55 89.46,49.02 88.7,49.78 85.34,49.78 | IC1.67 81.84,35.15 81.84,33.63 IC1.68 81.84,33.48 82.3,33.48 83.82,31.95 85.19,31.95 IC1.89 85.34,31.95 86.87,31.95 IC1.90 87.02,31.95 88.54,31.95 IC1.91 88.7,31.95 89,31.95 89.76,32.71 92.81,32.71 93.57,33.48 IC1.73 93.73,33.63 93.73,35.15 IC1.74 93.73,35.31 94.79,36.37 100.24,36.37 104.81,31.8 105.16,31.8 Q3.2 | IC1.102 85.19,43.69 85.19,37.29 83.97,36.07 82.6,36.07 81.84,35.31 IC1.67 | R23.2 59.59,11.07 60.05,11.07 61.27,12.29 62.79,12.29 63.55,11.53 C24.2 63.7,11.53 67.36,11.53 69.65,13.82 70.26,13.82 | R24.1 59.59,14.28 60.96,14.28 61.42,13.82 62.64,13.82 63.55,14.73 C25.2 65.08,14.73 68.73,18.39 69.8,18.39 70.1,18.09 70.1,13.97 70.26,13.82 | 70.26,13.82 71.63,13.82 72.54,14.73 72.54,15.95 IC8.3 72.54,16.1 72.54,17.32 70.87,19 64.47,19 63.7,18.24 C26.2 63.55,18.09 63.09,18.09 61.72,16.71 56.39,16.71 55.78,17.32 | D6.A 55.02,20.07 51.82,20.07 C34.2 51.66,20.22 49.53,22.35 44.04,22.35 41,19.3
  Top 0.152: 55.78,17.32 55.63,17.17 51.36,17.17 46.79,21.74 44.35,21.74 44.04,21.44 44.04,18.85 44.2,18.69 44.5,18.69 49.07,14.12 50.75,14.12 51.66,13.21 53.8,13.21 C32.2 | 55.78,17.32 55.78,19.46 55.17,20.07 D6.A | IC1.70 86.87,30.28 85.34,30.28 IC1.69 85.19,30.12 82.3,30.12 77.87,25.7 | IC1.31 94.79,26.92 94.79,27.38 92.05,30.12 90.37,30.12 IC1.72 90.22,30.28 88.7,30.28 IC1.71 88.54,30.28 87.02,30.28 IC1.70 | 61.42,29.52 61.42,29.21 60.81,28.6 60.81,27.23 61.42,26.62 Q5.2 61.42,26.47 61.42,23.88 C20.2 61.27,23.88 57.76,23.88 C19.2 57.61,23.72 55.17,21.29 55.17,20.22 D6.A | 61.42,29.52 61.42,31.19 Q4.2 61.57,31.19 63.4,31.19 63.55,31.34 63.55,32.11 61.57,34.09 61.57,36.52 Q7.2 | 61.42,29.52 64.47,26.47 64.47,23.88 C21.2 64.62,23.88 67.82,23.88 C22.2 67.97,23.88 76.05,23.88 77.87,25.7 | 77.87,25.7 76.5,27.07 76.5,35.15 77.88,36.52 79.25,36.52 80.47,35.31 81.69,35.31 IC1.67 | C10.2 95.4,10.46 95.4,17.37 86.87,25.91 86.87,30.12 IC1.70 | 58.98,53.59 58.98,53.14 | 58.98,53.14 58.98,50.24 D3.C | 58.98,53.59 58.98,57.1 D5.C 58.98,57.25 v58.98,67.31 | 58.98,53.59 D4.C 58.98,53.14 | 40.06,49.76 40.69,49.12 40.69,46.43 IC3.11 | v38.1,57.4 38.08,57.42 | 38.08,57.42 38.06,57.44 35.01,57.44 34.59,57.86 33.83,57.86 IC3.81 | v38.1,57.4 38.03,57.47 38.03,57.66 31.89,63.8 9.45,63.8 7.62,65.63 | 40.06,49.76 40.84,50.55 40.84,51.61 36.56,55.9 38.08,57.42 | IC3.62 42.34,62.3 42.34,61.52 42.04,61.21 v42.04,59.18 | v38.1,57.4 | v45.06,53.14 46.89,51.31 49.68,51.31 IC3.32 | v56.54,53.14 58.98,53.14 | R1.1 5.06,56.13 4.32,56.88 4.32,62.33 7.62,65.63 | 7.62,65.63 7.62,66.85 10.82,70.05 19.05,70.05 ARDUINO_DEBUG.24
  Top 0.152: v74.34,76.06 74.49,75.91 74.49,73.99 72.54,72.03 69.95,72.03 IC4.11 | PGM3.1 83.67,95.2 77.88,95.2 75.89,97.18 64.92,97.18 62.94,95.2 RF.3 | 111.71,48.56 111.4,48.26 111.4,47.95 105.46,42.01 Q2.2 | 111.71,48.56 115.82,48.56 116.89,47.5 S3.A2 117.04,47.35 117.96,46.43 117.96,38.66 117.2,37.9 117.2,36.22 S4.A2 | 76.81,66.24 76.81,67.16 C12.1 | 76.81,66.24 76.81,63.65 C11.1 | 85.34,67.16 86.61,67.16 87.89,68.44 89.67,68.44 | 85.34,67.16 84.12,67.16 R16.2 83.97,67.16 82.94,68.19 81.5,68.19 79.55,66.24 76.81,66.24 | C29.2 90.44,67.58 89.63,68.39 89.67,68.44 | 90.37,69.9 90.37,69.14 89.67,68.44 | 90.37,69.9 90.37,70.51 C28.2 | 123.75,49.48 123.75,49.33 125.73,47.35 S5.A2 | 123.75,49.48 123.75,51.16 124.21,51.61 124.21,54.2 C14.2 | 85.8,82.86 85.95,83.01 86.26,83.01 D9.2 | 85.8,82.86 85.8,81.64 86.11,81.33 86.11,78.28 89.76,74.62 | 89.76,74.62 90.22,74.17 C27.2 | 103.33,68.99 102.87,68.99 102.06,69.79 | 102.06,69.79 102.12,69.79 103.87,71.54 107.02,71.54 107.64,70.92 107.64,64.37 120.55,51.46 120.55,50.09 121.16,49.48 123.75,49.48 | 103.33,68.99 103.48,68.99 J8.C8(GND) | 96.01,75.84 94.64,77.22 94.64,78.13 94.34,78.44 93.57,78.44 89.76,74.62 | 96.01,75.84 102.06,69.79 | 103.33,68.99 J8.C8(GND) | 90.37,69.9 94.64,69.9 95.1,70.36 95.1,74.93 96.01,75.84 | 111.71,48.56 111.71,59.08 103.63,67.16 103.63,68.83 J8.C8(GND) | 85.8,82.86 v85.8,86.21 | 85.34,67.16 85.34,49.78 | 40.06,49.76 35.98,49.76 35.08,48.86 IC3.99
  Bottom 0.152: J6.P1 119.63,4.06 120.24,4.06 122.22,2.08 J6.P3 | J3_RX_TX_DBG.3 125.12,13.97 125.12,12.9 124.05,11.84 124.05,5.13 124.97,4.22 J6.P2 | v38.1,57.4 40.17,57.4 44.44,53.14 v45.06,53.14 v56.54,53.14 | v42.04,59.18 41.94,59.18 40.15,57.39 | U$1.GND@1 8.99,97.94 8.99,84.53 17.83,75.69 17.83,71.43 19.05,70.21 ARDUINO_DEBUG.24 | RF.3 62.94,95.05 74.29,83.7 74.29,76.12 v74.34,76.06 73.79,76.62 71.64,76.62 70.26,75.23 68.02,75.23 60.1,67.31 v58.98,67.31 | v85.8,86.21 83.82,88.19 83.82,95.05 PGM3.1
GNSS_RX  (via drill 0.35)
  Top 0.152: v47.56,37.84 46.02,36.3 46.02,34.7 EG1390.1 | v73.03,75.76 72.56,75.29 69.9,75.29 IC4.16
  Route15 0.152: v47.56,37.84 47.56,40.98 54.66,48.08 54.66,55.97 73.08,74.39 73.08,75.71 v73.03,75.76
GNSS_RXD  (via drill 0.35)
  Top 0.152: v90.83,27.99 91.59,27.23 91.59,26.92 IC1.28 | v67.97,60.45 67.97,61.82 62.33,67.46 62.33,74.32 63.25,75.23 63.86,75.23 IC4.5
  Bottom 0.152: v90.83,27.99 88.7,27.99 87.48,26.77 80.47,26.77 79.86,27.38 79.86,41.1 67.97,52.98 v67.97,60.45
GNSS_TX  (via drill 0.35)
  Top 0.152: v41.45,34.24 45.87,29.82 45.87,29.06 EG1390.4 | v72.27,74.64 72.1,74.47 69.95,74.47 IC4.15
  Route15 0.152: v41.45,34.24 41.45,40.95 50.9,50.39 50.9,56.01 53.42,58.52 56.15,58.52 v72.27,74.64
GNSS_TXD  (via drill 0.35)
  Top 0.152: v87.8,28.45 89.15,28.45 90.37,27.23 90.37,26.92 IC1.27 | v67.97,63.2 67.97,63.8 62.64,69.14 62.64,74.02 63.09,74.47 63.86,74.47 IC4.6
  Bottom 0.152: v87.8,28.45 84.89,28.45 83.52,27.08 80.62,27.08 80.16,27.53 80.16,49.48 67.97,61.67 v67.97,63.2
MISO  (via drill 0.35)
  Top 0.152: v46.2,48.54 46.2,46.44 IC3.22
  Route15 0.152: v46.2,48.54 45.41,48.54 45.11,48.84 45.11,50.09 50.29,55.27 50.29,77.67 67.67,95.05 RF.5
  Bottom 0.152: PGM3.3 88.85,95.05 89.15,95.05 90.83,93.37 91.75,93.37 92.35,93.98 92.35,96.27 91.44,97.18 69.8,97.18 67.82,95.2 RF.5
MOSI  (via drill 0.35)
  Top 0.152: v45.72,49.78 45.21,49.28 45.21,48.05 45.78,47.37 IC3.21
  Route15 0.152: v45.72,49.78 45.72,50.24 50.6,55.12 50.6,75.39 70.26,95.05 RF.6
  Bottom 0.152: PGM3.4 91.29,95.2 90.98,95.2 89.31,96.88 72.08,96.88 70.41,95.2 RF.6
N$1
  Top 0.152: R5.1 5.04,66.29 3.58,64.84 3.58,50.77 Q1.2
N$2
  Top 0.152: R3.1 6.71,61.21 6.71,57.71 7.62,56.79 7.62,50.39 7.47,50.24 Q1.3
N$3
  Top 0.152: R4.1 34.29,15.95 33.22,17.02 33.22,19 34.29,20.07 ON.A
N$4
  Top 0.152: R22.1 59.28,7.72 59.28,9.4 57.76,10.92 R23.1 57.76,11.07 58.06,11.07 60.5,13.51 66.75,13.51 69.19,15.95 IC8.5
N$5
  Top 0.152: Q6.3 44.5,14.28 44.5,10.31 R21.2 44.65,10.16 45.11,10.16 48.92,6.35 62.94,6.35 63.55,6.96 64.01,6.96 66.6,9.55 66.6,10.31 69.8,13.51 74.68,13.51 76.05,14.88 76.05,15.95 IC8.1
N$6
  Top 0.152: MAIN_ANT.FEED C15.1 105.92,9.09 102.26,9.09 R28.1
N$7
  Top 0.152: 89.8,86.09 88.76,87.12 85.34,87.12 84.89,86.67 84.89,72.15 86.42,70.61 C28.1 88.7,70.66 89.61,71.58 90.83,71.58 91.59,70.82 94.03,70.82 R25.1 | D9.4 88.09,82.55 88.24,82.55 89.79,84.1 89.79,86.08 89.8,86.09 | J8.CLK 110.94,93.4 109.76,94.58 98.28,94.58 89.8,86.09
N$8  (via drill 0.35)
  Top 0.152: 94.34,66.4 94.34,65.79 96.01,64.11 R27.2 | 94.34,66.4 94.34,67.31 R26.1 | v88.7,79.96 87.17,81.48 87.17,83.01 86.72,83.46 86.41,83.46 D9.1 | C29.1 88.7,67.31 88.7,66.4 92.32,66.4 | v108.42,68.99 110.8,68.99 J8.I/O | 92.32,66.4 94.34,66.4 | 92.32,66.4 v92.32,67.76
  Bottom 0.152: v92.32,67.76 92.32,68.99 | v88.7,79.96 88.7,68.99 92.32,68.99 | 92.32,68.99 v108.42,68.99
N$11  (via drill 0.35)
  Top 0.152: v94.94,47.19 95.25,47.5 96.93,47.5 IC1.49 | v91.44,10.77 91.44,9.55 C9.2
  Bottom 0.152: v94.94,47.19 94.97,47.17 94.97,28.02 91.44,24.49 v91.44,10.77
N$12
  Top 0.152: L1.2 90.98,11.53 90.98,11.23 89.76,10.01 89.76,9.55 C9.1 89.76,9.4 90.53,8.64 90.53,4.98 GNSS_ANT.FEED
N$13
  Top 0.152: 87.48,83.31 86.41,84.38 86.41,86.51 86.11,86.82 85.5,86.82 85.19,86.51 85.19,81.79 85.8,81.18 85.8,76.76 88.39,74.17 C27.1 88.54,74.02 89.46,73.1 90.83,73.1 91.75,74.02 93.88,74.02 R19.1 | 87.48,83.31 87.63,83.16 87.94,83.16 D9.5 | J8.RST 113.48,91.25 111.89,89.65 110.08,89.65 105.86,93.88 102.39,93.88 90.6,82.09 87.63,82.09 87.48,82.25 87.48,83.31
N$14
  Top 0.152: L1.1 90.22,11.53 87.02,11.53 85.95,10.46 R6.2
N$15  (via drill 0.35)
  Top 0.152: R15.2 83.97,63.8 82.3,65.48 82.3,67.01 R16.1 82.14,67.01 v81.23,67.01 | v65.25,70.29 63.7,71.84 63.99,71.84 IC4.10
  Bottom 0.152: v65.25,70.29 77.94,70.29 v81.23,67.01
N$17
  Top 0.152: R7.2 107.9,24.03 112.47,24.03 S2.B2
N$18
  Top 0.152: R8.2 119.94,50.39 119.94,48.72 121.31,47.35 S5.B2
N$19
  Top 0.152: Q4.3 62.94,31.8 60.35,34.39 58.52,34.39 R10.2
N$20
  Top 0.152: R10.1 58.37,32.71 56.84,32.71 54.86,34.7 D2.C
N$21
  Top 0.152: R11.1 65.84,50.24 62.03,50.24 D3.A
N$22
  Top 0.152: D4.A R12.1
N$23
  Top 0.152: R13.1 65.53,57.1 62.03,57.1 D5.A
N$28
  Top 0.152: R20.1 58.37,26.62 55.17,26.62 54.86,26.31 D7.C
PSM_IND
  Top 0.152: Q7.1 61.57,37.59 71.48,47.5 78.49,47.5 IC1.1
PSM_IND_M  (via drill 0.35)
  Top 0.152: Q7.3 64.21,38.31 v64.21,38.66 | v59.23,40.82 59.23,39.43 R29.2 58.52,38.81 58.52,43.84 v52.81,49.55 | IC3.38 51.05,54.36 51.21,54.2 54.61,54.2 54.66,54.25 54.66,57.15 54.3,57.51 v53.42,57.51 | v44.32,65.46 43.94,65.08 33.17,65.08 28.19,70.05 21.64,70.05 ARDUINO_DEBUG.23
  Route15 0.152: v52.81,49.55 53.02,49.76 53.02,57.1 v53.42,57.51
  Bottom 0.152: v64.21,38.66 61.39,38.66 v59.23,40.82 | v44.32,65.46 45.47,65.46 v53.42,57.51
PWRIN  (via drill 0.35)
  Top 0.152: v8.53,60.15 8.53,61.21 R3.2 | D1.A 5.18,8.18 8.84,8.18 12.04,4.98 12.04,3.15 11.89,3 5.94,3 SL1.1
  Bottom 0.152: v8.53,60.15 8.53,54.66 3.35,49.48 3.35,5.59 5.79,3.15 SL1.1
PWRKEY  (via drill 0.35, 0.35 layers 1-2)
  Top 0.152: v99.73,39.53 99.73,42.55 99.95,42.77 105.31,42.77 Q2.1 | v36.4,50.85 33.83,50.85 IC3.95
  Route2 0.152: v99.73,39.53 94.38,39.53 82.75,51.16 40.84,51.16 34.9,57.1 21.95,57.1 21.64,57.4 ARDUINO_DEBUG.13
  Bottom 0.152: v36.4,50.85 36.27,50.98 32.33,50.98 26.21,57.1 21.95,57.1 21.64,57.4 ARDUINO_DEBUG.13
PWRKEY_D
  Top 0.152: 107.44,42.47 106.98,42.47 Q2.3 | 107.44,42.47 112.32,47.35 S3.B2 | 107.44,42.47 111.56,38.35 112.17,38.35 117.96,32.56 117.96,23.11 117.81,22.96 99.97,22.96 97.54,25.4 97.54,25.55 92.05,31.04 84.73,31.04 84.28,31.5 78.64,31.5 IC1.15
RESET  (via drill 0.35, 0.35 layers 15-16)
  Top 0.152: C1.1 22.86,19.3 27.43,19.3 27.89,19.76 R2.1 28.04,19.91 v28.04,21.13 | v47.95,49.84 48.49,50.39 49.68,50.39 IC3.30 49.84,50.39 50.6,50.39 51.05,50.85 52.73,50.85 54.48,49.1 v56.08,49.1 | v32.16,26.62 30.33,26.62 29.57,25.86 S6.B2
  Route15 0.152: v57.28,55.63 57.91,54.99 57.91,50.29 56.72,49.1 v56.08,49.1
  Bottom 0.152: v47.95,49.84 47.95,42.03 32.54,26.62 v32.16,26.62 28.04,22.5 v28.04,21.13 | v57.28,55.63 57.28,63.82 65.95,72.49 73.46,72.49 93.73,92.76 93.73,95.05 PGM3.5
RESET_N  (via drill 0.35, 0.35 layers 1-2)
  Top 0.152: v90.07,42.62 91.44,41.25 94.18,41.25 94.49,40.95 94.49,38.81 96.32,36.98 101.04,36.98 105.16,32.87 Q3.1 | v40.23,50.85 39.62,50.24 34.75,50.24 34.59,50.39 33.83,50.39 IC3.96 33.68,50.39 32.92,50.39 32.61,50.7 v31.7,50.7
  Route2 0.152: v90.07,42.62 90.07,43.38 82.6,50.85 v40.23,50.85
  Bottom 0.152: ARDUINO_DEBUG.14 19.81,57.4 21.18,56.03 26.36,56.03 v31.7,50.7
RESET_N_D  (via drill 0.35 layers 1-2)
  Top 0.152: S4.B2 112.47,36.07 108.66,32.26 Q3.3 106.68,32.26 v105.31,33.63 | v84.12,30.73 81.02,30.73 79.64,29.36 78.64,29.36 IC1.17
  Route2 0.152: v84.12,30.73 91.03,30.73 93.92,33.63 v105.31,33.63
RF_SS  (via drill 0.35)
  Top 0.152: 51.97,63.96 56.29,59.64 56.29,54.33 54.79,52.83 49.84,52.83 IC3.35 | 51.97,63.96 51.97,71.73 75.29,95.05 RF.8 | v24.06,66.21 31.58,66.21 33.83,63.96 51.97,63.96
  Bottom 0.152: ARDUINO_DEBUG.20 19.81,65.02 21,66.21 v24.06,66.21
RI  (via drill 0.35)
  Top 0.152: v67.66,78 69.79,78 IC4.20 | ARDUINO_DEBUG.19 31.39,65.02 43.74,52.68 43.74,46.43 IC3.17
  Bottom 0.152: v67.66,78 65.09,78 57.15,70.05 29.36,70.05 24.34,65.02 ARDUINO_DEBUG.19
RI_D  (via drill 0.35)
  Top 0.152: v94.25,32.08 94.49,32.31 94.49,33.48 96.62,35.61 96.93,35.61 IC1.39 | v82.45,51.77 82.45,51.72 82.34,51.61 71.02,51.61 67.97,54.66 62.79,54.66 61.11,56.34 61.11,75.69 63.25,77.83 63.86,77.83 IC4.1
  Bottom 0.152: v94.25,32.08 94.25,41.64 88.09,47.8 86.41,47.8 v82.45,51.77
RST  (via drill 0.35)
  Top 0.152: v45.14,56.36 45.14,54.71 46.41,53.44 49.68,53.44 IC3.36 | v29.26,67.46 21.64,67.46 ARDUINO_DEBUG.21
  Bottom 0.152: v45.14,56.36 45.14,59.66 37.34,67.46 v29.26,67.46 | RF.2 60.3,75.39 56.16,71.25 27.1,71.25 23.47,67.62 21.64,67.62 ARDUINO_DEBUG.21
RXD2  (via drill 0.35)
  Top 0.152: v40.59,44.68 41.3,45.39 41.3,46.28 IC3.12
  Bottom 0.152: v40.59,44.68 37.57,44.68 32.46,49.78 23.32,49.78 22.1,51 20.27,51 ARDUINO_DEBUG.8
RXD3  (via drill 0.35 layers 1-2)
  Top 0.152: IC3.63 41.78,61.39 41.73,61.34 41.73,60.71 v40.29,59.26
  Route2 0.152: ARDUINO_DEBUG.10 20.32,53.59 20.34,53.59 20.34,58.2 20.8,58.65 26.61,58.65 27.2,58.07 37.61,58.07 38.8,59.26 v40.29,59.26
SCK
  Top 0.152: IC3.20 45.26,46.28 45.26,44.86 43.15,42.75 23.9,42.75 22.1,40.95 9.1,40.95 1.8,48.25 1.8,66.11 10.21,74.52 10.21,75.69 27.58,93.07 70.87,93.07 72.85,95.05 RF.7
  Bottom 0.152: PGM3.2 86.41,95.05 86.41,85.9 86.11,85.6 82.3,85.6 72.85,95.05 RF.7
SCL  (via drill 0.35)
  Top 0.152: v35.2,42.01 33.98,40.79 33.98,29.52 34.29,29.21 34.59,29.21 RN2.3 | v46.79,56.64 48.77,56.64 48.92,56.79 49.68,56.79 IC3.43
  Route15 0.152: v35.2,42.01 35.36,42.01 45.9,52.55 45.9,55.75 v46.79,56.64
SDA
  Top 0.152: RN2.2 34.75,29.97 34.9,29.97 35.36,30.43 35.36,33.32 43.13,41.1 50.42,41.1 52.3,42.98 52.3,44.12 44.35,52.07 44.35,56.97 44.78,57.4 49.68,57.4 IC3.44
SENSE_PIN  (via drill 0.35)
  Top 0.152: Q1.1 9.73,47.62 10.44,48.34 10.44,54.37 R1.2 8.69,56.18 13.72,61.21 20.27,61.21 21.49,59.99 ARDUINO_DEBUG.15 | v24.31,57.71 24.31,55.29 29.67,49.94 33.68,49.94 IC3.97
  Bottom 0.152: ARDUINO_DEBUG.15 22.08,59.94 v24.31,57.71
SIM_CLK
  Top 0.152: IC1.46 97.08,44.3 97.54,44.75 97.69,44.75 98.75,45.82 98.75,67.92 96.01,70.66 R25.2
SIM_DATA  (via drill 0.35)
  Top 0.152: v95.62,43.22 95.64,43.23 96.93,43.23 IC1.45 | v95.71,57.71 95.71,62.28 96.77,63.35 96.77,66.7 96.16,67.31 R26.2
  Bottom 0.152: v95.71,57.71 95.62,57.63 v95.62,43.22
SIM_GND  (via drill 0.35)
  Top 0.152: 97.84,54.66 97.84,45.97 97.69,45.82 97.54,45.82 97.08,45.36 IC1.47 | 97.84,54.66 90.53,61.98 90.53,63.8 C35.2 | v110.03,62.89 115.98,68.83 J8.GND | 97.84,54.66 v98.15,54.97
  Bottom 0.152: v110.03,62.89 106.07,62.89 v98.15,54.97
SIM_PRESENCE
  Top 0.152: 94.49,78.74 89,78.74 86.41,81.33 86.41,82.55 D9.3 | 94.49,78.74 95.71,77.52 R14.2 | 94.49,78.74 103.48,87.73 103.48,92 J8.PRSNC
SIM_RST
  Top 0.152: IC1.44 97.08,42.16 97.38,42.47 97.54,42.47 99.06,43.99 99.06,70.82 95.86,74.02 R19.2
SIM_VDD  (via drill 0.35)
  Top 0.152: D9.6 88.54,84.14 v88.54,85.87 | v86.25,65.3 87.37,64.18 88.33,64.18 C35.1 88.7,63.96 89.46,64.72 90.98,64.72 91.59,64.11 94.18,64.11 R27.1 | v91.44,43.54 93.73,43.54 96.16,41.1 96.93,41.1 IC1.43 | v117.92,92.15 116.05,92.15 J8.VCC
  Bottom 0.152: v91.44,43.54 88.54,43.54 80.16,51.92 80.16,59.2 v86.25,65.3 86.25,83.59 v88.54,85.87 94.82,92.15 v117.92,92.15
STATUS
  Top 0.152: Q5.1 61.57,27.53 63.55,25.55 63.55,23.27 63.7,23.11 77.88,23.11 81.53,26.77 IC1.20
TXD2
  Top 0.152: IC3.13 41.76,46.28 41.76,44.55 41.2,43.99 27.43,43.99 21.64,49.78 ARDUINO_DEBUG.7
TXD3  (via drill 0.35)
  Top 0.152: v37.57,60.3 40.08,60.3 41.3,61.52 41.3,62.28 IC3.64
  Bottom 0.152: v37.57,60.3 34.44,60.3 33.66,61.09 22.25,61.06 22.1,61.21 21.18,61.21 20.27,60.3 20.27,59.38 19.51,58.62 18.59,58.62 17.83,57.86 17.83,54.36 18.59,53.59 19.81,53.59 21.03,52.38 21.49,52.38 ARDUINO_DEBUG.9
USB_BOOT
  Top 0.152: IC1.75 93.73,36.98 95.86,36.98 96.16,36.68 100.74,36.68 104.7,32.71 104.7,32.41 104.85,32.26 105.77,32.26 112.93,25.1 116.13,25.1 117.04,24.18 S2.A2
USB_DM  (via drill 0.35)
  Top 0.152: IC1.10 77.81,37.65 76.36,39.09 v73.97,39.09 | v89.31,25.4 96.2,18.51 99.86,18.51 106.47,11.89 118.49,11.89 121.61,8.77 121.61,4.06 J6.D-
  Bottom 0.152: v73.97,39.09 73.97,32.81 81.38,25.4 v89.31,25.4
USB_DP  (via drill 0.35 layers 1-2)
  Top 0.152: v80.03,38.6 79.97,38.66 78.64,38.66 IC1.9 | v94.64,24.16 98.32,24.16 109.83,12.64 118.96,12.64 122.22,9.38 122.22,4.06 J6.D+
  Route2 0.152: v80.03,38.6 80.03,33.92 87.63,26.31 92.48,26.31 v94.64,24.16
USB_VBUS  (via drill 0.35)
  Top 0.152: J6.VBUS 121,6.35 120.54,6.8 v120.54,7.9 | v87.08,48.73 85.39,47.04 84.88,47.04 80.01,42.16 80.01,41.1 79.25,40.34 79.1,40.34 78.64,39.88 IC1.8 | J4_USB_VBUS.1 125.27,19 125.27,19.76 126.49,20.98 126.49,25.1 125.42,26.16 J5_USB_EN_VBUS.1
  Bottom 0.152: v120.54,7.9 120.54,14.27 125.12,18.85 J4_USB_VBUS.1 | v87.08,48.73 87.08,53.88 92.59,59.39 96.12,59.39 97.54,57.98 97.54,52.34 119.9,29.97 125.88,29.97 126.64,29.21 126.64,27.38 125.42,26.16 J5_USB_EN_VBUS.1
USER_BUTTON  (via drill 0.35)
  Top 0.152: 121.84,53.67 122.38,54.2 C14.1 122.53,54.36 123.29,55.12 124.66,55.12 124.97,54.81 124.97,53.59 124.51,53.14 124.51,50.55 R9.1 | 121.84,53.67 121.77,53.59 121.77,50.55 R8.1 | v37.8,55.57 42.82,50.55 42.82,46.43 IC3.15 | v29.41,60.45 23.62,60.45 ARDUINO_DEBUG.17 | v120.14,53.67 121.84,53.67
  Route2 0.152: v80.77,52.38 79.86,51.46 41.91,51.46 v37.8,55.57
  Bottom 0.152: v37.8,55.57 34.29,55.57 v29.41,60.45 | v120.14,53.67 120.14,55.46 112.1,63.5 91.9,63.5 v80.77,52.38
USER_LED  (via drill 0.35)
  Top 0.152: v65.84,52.07 67.67,50.24 R11.2 | v38.18,48.59 38.05,48.59 37.78,48.32 IC3.5
  Bottom 0.152: v65.84,52.07 38.66,52.07 36.68,50.09 | 36.68,50.09 30.5,50.09 30.33,50.27 30.33,51.61 27.13,54.81 21.64,54.81 ARDUINO_DEBUG.11 | 36.68,50.09 v38.18,48.59
VBAT_BB  (via drill 0.35)
  Top 0.152: D6.C 55.02,17.78 51.21,17.78 46.94,22.05 44.2,22.05 43.74,21.59 43.74,18.69 47.4,15.04 47.7,15.04 48.92,13.82 50.6,13.82 56.84,7.57 56.84,6.96 57.15,6.65 60.35,6.65 61.57,7.87 R18.1 61.72,7.87 v61.72,9.7 61.72,11.38 C24.1 | IC1.32 96.93,28.14 96.93,29.06 IC1.33 96.93,29.21 95.04,29.21 v93.94,30.32 | v60.81,15.65 61.72,14.73 C25.1 | v60.81,17.32 61.72,18.24 C26.1 | v63.86,6.35 63.86,4.37 62.79,3.3 C23.1
  Bottom 0.152: v93.94,30.32 93.94,27.86 83.4,17.32 v60.81,17.32 v60.81,15.65 63.86,12.6 63.86,9.7 | 63.86,9.7 v63.86,6.35 | 63.86,9.7 v61.72,9.7
VBAT_RF  (via drill 0.35)
  Top 0.152: IC1.52 92.66,48.87 91.75,48.87 IC1.53 91.59,48.87 91.59,48.56 89.31,46.28 84.58,46.28 80.72,42.42 80.72,37.6 79.95,36.83 73.53,36.83 v72.87,36.18 | 59.44,20.07 59.44,18.09 R17.2 | 59.44,20.07 57.76,21.74 C19.1 | 59.44,20.07 61.27,21.89 C20.1 61.42,22.05 64.47,22.05 C21.1 64.62,22.05 67.82,22.05 C22.1 67.97,22.05 68.43,22.5 v69.19,22.5
  Bottom 0.152: v72.87,36.18 72.78,36.09 72.78,26.1 v69.19,22.5
VCC  (via drill 0.35)
  Top 0.152: v57.61,19.3 57.61,18.09 R17.1 | v56.69,27.23 54.86,29.06 D7.A D2.A 54.86,31.8 53.8,32.87 53.8,35.46 53.95,35.61 58.89,35.61 59.76,36.49 59.76,36.85 68.43,45.52 68.43,50.85 67.67,51.61 67.67,53.59 R12.2 | v62.94,10.31 63.4,9.86 63.4,7.87 R18.2
  Bottom 0.152: v56.69,27.23 57.61,26.31 v57.61,19.3 57.61,17.93 62.94,12.6 v62.94,10.31
VDD_EXT  (via drill 0.35)
  Top 0.152: v93.03,23.21 92.81,23.42 92.81,26.77 IC1.29 92.66,26.92 v92.66,28.6 | v98.15,25.71 104.24,25.71 105.92,24.03 R7.1 | 74.37,62.43 73.61,62.43 69.65,66.4 68.43,66.4 66.9,67.92 66.9,74.93 64.77,77.06 64.01,77.06 IC4.2 | 74.37,62.43 77.42,62.43 78.49,63.5 C11.2 | 81.84,63.65 81.08,63.65 72.69,55.27 67.06,55.27 66.75,55.57 66.75,57.86 70.1,61.21 74.07,61.21 74.37,61.52 74.37,62.43 | 81.84,63.65 82.14,63.65 R15.1 | v86.16,72.21 93.6,72.21 94.64,73.25 94.64,74.78 94.03,75.39 94.03,77.37 R14.1 | 81.84,63.65 v81.84,65.02
  Bottom 0.152: v98.15,25.71 95.55,23.1 93.13,23.1 v93.03,23.21 | v86.16,72.21 86.16,69.34 v81.84,65.02 79.86,63.04 79.86,51.77 91.48,40.15 91.48,29.78 v92.66,28.6
VIN1
  Top 0.152: C2.1 4.12,17.17 4.12,13.66 5.03,12.75 D1.C 5.18,12.6 6.55,12.6 15.09,4.06 PC1.+ 15.24,4.06 22.55,11.38 22.55,11.84 IC2.3
XTAL1R
  Top 0.152: C8.1 11.89,28.3 12.8,29.21 19.36,29.21 Y2.2 19.51,29.21 21.34,27.38 50.9,27.38 53.01,29.49 53.01,35.13 55.47,37.59 60.05,37.59 60.66,38.2 60.66,46.41 54.69,52.38 49.84,52.38 IC3.34
XTAL2
  Top 0.152: C7.1 11.73,33.78 12.65,32.87 17.83,32.87 19.36,34.39 Y2.1 19.51,34.39 26.21,27.69 49.21,27.69 49.87,28.34 49.87,29.24 52.48,31.86 52.48,35.06 55.32,37.9 59.89,37.9 60.35,38.35 60.35,46.13 54.71,51.77 49.84,51.77 IC3.33

## Text on the board
tValues: RST | IRQ | SCK | SCK | +5V | +3V3 | GND | MISO | MOSI | GND | MISO | MOSI | CLK | RST | VCC | RF_SS | RESET | PRESENCE | PSM_IND_M | GND | GND | I/O | VPP | GND | BC547 | RST | RF_SS | RI | APREADY | USR_BTN | ENABLE | SNS_PIN | RESET_N | PWRKEY | A_STATUS | USR_LED | TXD3 | RXD3 | RXD2 | TXD2 | A_RX | A_TX | ESP_RX | ESP_TX | AT_COMM_RX | AT_COMM_TX | VIN1 | GND | A4 | D42 | GND | A5 | D43 | PWRIN | A6 | D44 | A7 | D45
tDocu: USB_VBUS | ENABLE | +5V | USB_VBUS | 5 | 4 | 3 | 2 | 1 | GND | DBG_RX | DBG_TX | USB_VBUS | USB_DM | USB_DP | ID | GND